# EAGLE schematic Backplane_2014 (EAGLE 5.06)
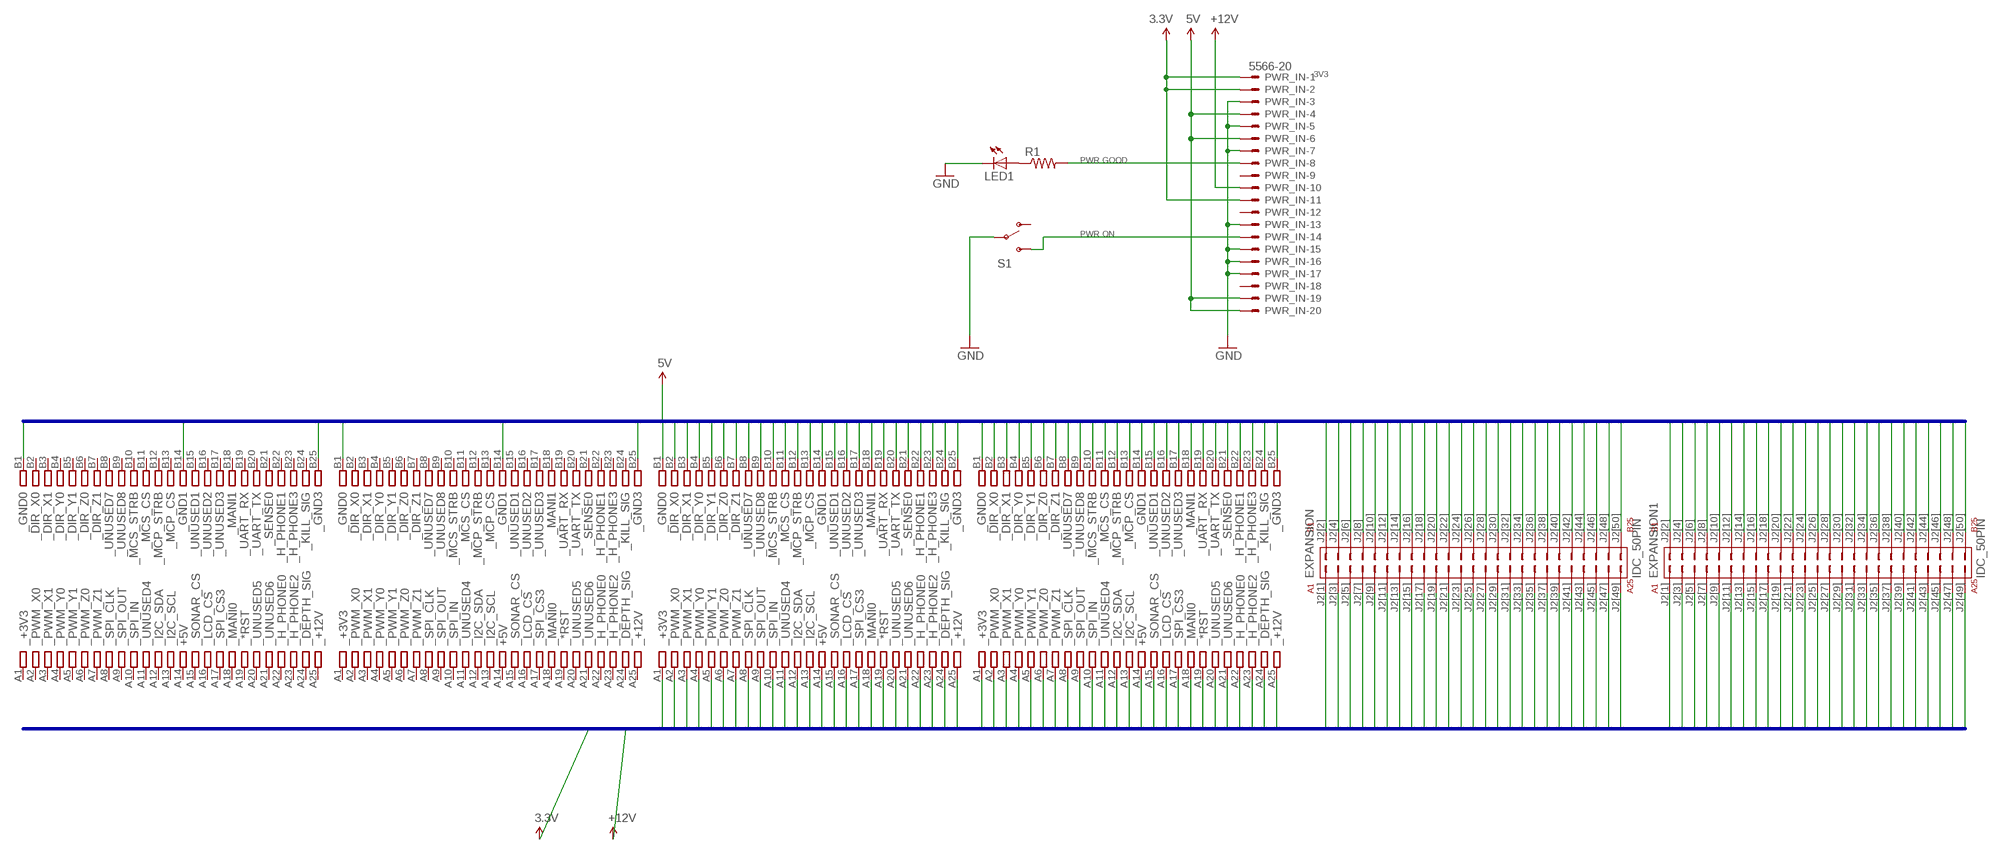
[diagram p0: schematic, sheet 1]

## Parts
EXPANSION  IDC_50PIN  [50PIN_BREAKOUT]
EXPANSION1  IDC_50PIN  [50PIN_BREAKOUT]
LED1  LED5MM  [LED5MM]
PWR_IN  5566-20  [5566-20]
R1  R-US_0204/7  [0204/7]
S1  SWITCH-SPST  [SWITCH-3PIN-5.47]
U$1  CONN_50PIN  [CONN_50PIN]
U$2  CONN_50PIN  [CONN_50PIN]
U$4  CONN_50PIN  [CONN_50PIN]
U$9  CONN_50PIN  [CONN_50PIN]

## Nets
3.3V: PWR_IN.1 PWR_IN.2 PWR_IN.11
3V3: EXPANSION1.J2[1](A1) EXPANSION.J2[1](A1) U$1.A1 U$2.A1 ; supply symbol labelled 3.3V
5V: EXPANSION1.J2[2](B1) EXPANSION.J2[2](B1) PWR_IN.4 PWR_IN.6 PWR_IN.19 PWR_IN.20 U$1.B1 U$2.B1
12V: EXPANSION1.J2[49](A25) EXPANSION.J2[49](A25) PWR_IN.10 U$1.A25 U$2.A25 ; supply symbol labelled +12V
DEPTH_SIG: EXPANSION1.J2[47](A24) EXPANSION.J2[47](A24) U$1.A24 U$2.A24
DIR_X0: EXPANSION1.J2[4](B2) EXPANSION.J2[4](B2) U$1.B2 U$2.B2
DIR_X1: EXPANSION1.J2[6](B3) EXPANSION.J2[6](B3) U$1.B3 U$2.B3
DIR_Y0: EXPANSION1.J2[8](B4) EXPANSION.J2[8](B4) U$1.B4 U$2.B4
DIR_Y1: EXPANSION1.J2[10](B5) EXPANSION.J2[10](B5) U$1.B5 U$2.B5
DIR_Z0: EXPANSION1.J2[12](B6) EXPANSION.J2[12](B6) U$1.B6 U$2.B6
DIR_Z1: EXPANSION1.J2[14](B7) EXPANSION.J2[14](B7) U$1.B7 U$2.B7
ETPU6: EXPANSION1.J2[15](A8) EXPANSION.J2[15](A8) U$1.A8 U$2.A8
ETPU7: EXPANSION1.J2[17](A9) EXPANSION.J2[17](A9) U$1.A9 U$2.A9
ETPU8: EXPANSION1.J2[19](A10) EXPANSION.J2[19](A10) U$1.A10 U$2.A10
ETPU9: EXPANSION1.J2[21](A11) EXPANSION.J2[21](A11) U$1.A11 U$2.A11
GND: EXPANSION1.J2[27](A14) EXPANSION1.J2[28](B14) EXPANSION1.J2[50](B25) EXPANSION.J2[27](A14) EXPANSION.J2[28](B14) EXPANSION.J2[50](B25) LED1.K(C) PWR_IN.3 PWR_IN.5 PWR_IN.7 PWR_IN.13 PWR_IN.15 PWR_IN.16 PWR_IN.17 S1.P$2(P) U$1.A14 U$1.B14 U$1.B25 U$2.A14 U$2.B14 U$2.B25 U$4.B1 U$4.B14 U$4.B25 U$9.B1 U$9.B14 U$9.B25
H_PHONE0: EXPANSION1.J2[43](A22) EXPANSION.J2[43](A22) U$1.A22 U$2.A22
H_PHONE1: EXPANSION1.J2[44](B22) EXPANSION.J2[44](B22) U$1.B22 U$2.B22
H_PHONE2: EXPANSION1.J2[45](A23) EXPANSION.J2[45](A23) U$1.A23 U$2.A23
H_PHONE3: EXPANSION1.J2[46](B23) EXPANSION.J2[46](B23) U$1.B23 U$2.B23
I2C_SCL: EXPANSION1.J2[25](A13) EXPANSION.J2[25](A13) U$1.A13 U$2.A13
I2C_SDA: EXPANSION1.J2[23](A12) EXPANSION.J2[23](A12) U$1.A12 U$2.A12
KILL_SIG: EXPANSION1.J2[48](B24) EXPANSION.J2[48](B24) U$1.B24 U$2.B24
MANI0: EXPANSION1.J2[35](A18) EXPANSION.J2[35](A18) U$1.A18 U$2.A18
MANI1: EXPANSION1.J2[36](B18) EXPANSION.J2[36](B18) U$1.B18 U$2.B18
MANI2: EXPANSION1.J2[37](A19) EXPANSION.J2[37](A19) U$1.A19 U$2.A19
MCP_CS: EXPANSION1.J2[20](B10) EXPANSION.J2[20](B10) U$1.B10 U$2.B10
MCP_STRB: EXPANSION1.J2[22](B11) EXPANSION.J2[22](B11) U$1.B11 U$2.B11
MCS_CS: EXPANSION1.J2[24](B12) EXPANSION.J2[24](B12) U$1.B12 U$2.B12
MCS_STRB: EXPANSION1.J2[26](B13) EXPANSION.J2[26](B13) U$1.B13 U$2.B13
N$1: LED1.A R1.1
N$10: PWR_IN.14 S1.P$3(S)
N$11: PWR_IN.8 R1.2
PWM_X0: EXPANSION1.J2[3](A2) EXPANSION.J2[3](A2) U$1.A2 U$2.A2
PWM_X1: EXPANSION1.J2[5](A3) EXPANSION.J2[5](A3) U$1.A3 U$2.A3
PWM_Y0: EXPANSION1.J2[7](A4) EXPANSION.J2[7](A4) U$1.A4 U$2.A4
PWM_Y1: EXPANSION1.J2[9](A5) EXPANSION.J2[9](A5) U$1.A5 U$2.A5
PWM_Z0: EXPANSION1.J2[11](A6) EXPANSION.J2[11](A6) U$1.A6 U$2.A6
PWM_Z1: EXPANSION1.J2[13](A7) EXPANSION.J2[13](A7) U$1.A7 U$2.A7
SENSE0: EXPANSION1.J2[38](B19) EXPANSION.J2[38](B19) U$1.B19 U$2.B19
SPARE0: EXPANSION1.J2[16](B8) EXPANSION.J2[16](B8) U$1.B8 U$2.B8
SPARE1: EXPANSION1.J2[18](B9) EXPANSION.J2[18](B9) U$1.B9 U$2.B9
SPARE2: EXPANSION1.J2[39](A20) EXPANSION.J2[39](A20) U$1.A20 U$2.A20
SPARE3: EXPANSION1.J2[40](B20) EXPANSION.J2[40](B20) U$1.B20 U$2.B20
SPARE4: EXPANSION1.J2[41](A21) EXPANSION.J2[41](A21) U$1.A21 U$2.A21
SPARE5: EXPANSION1.J2[42](B21) EXPANSION.J2[42](B21) U$1.B21 U$2.B21
SPI_CLK: EXPANSION1.J2[33](A17) EXPANSION.J2[33](A17) U$1.A17 U$2.A17
SPI_CS1: EXPANSION1.J2[30](B15) EXPANSION.J2[30](B15) U$1.B15 U$2.B15
SPI_CS2: EXPANSION1.J2[32](B16) EXPANSION.J2[32](B16) U$1.B16 U$2.B16
SPI_CS3: EXPANSION1.J2[34](B17) EXPANSION.J2[34](B17) U$1.B17 U$2.B17
SPI_IN: EXPANSION1.J2[29](A15) EXPANSION.J2[29](A15) U$1.A15 U$2.A15
SPI_OUT: EXPANSION1.J2[31](A16) EXPANSION.J2[31](A16) U$1.A16 U$2.A16
Unconnected: PWR_IN.9 PWR_IN.12 PWR_IN.18 S1.P$1(O) U$4.A1 U$4.A2 U$4.A3 U$4.A4 U$4.A5 U$4.A6 U$4.A7 U$4.A8 U$4.A9 U$4.A10 U$4.A11 U$4.A12 U$4.A13 U$4.A14 U$4.A15 U$4.A16 U$4.A17 U$4.A18 U$4.A19 U$4.A20 U$4.A21 U$4.A22 U$4.A23 U$4.A24 U$4.A25 U$4.B2 U$4.B3 U$4.B4 U$4.B5 U$4.B6 U$4.B7 U$4.B8 U$4.B9 U$4.B10 U$4.B11 U$4.B12 U$4.B13 U$4.B15 U$4.B16 U$4.B17 U$4.B18 U$4.B19 U$4.B20 U$4.B21 U$4.B22 U$4.B23 U$4.B24 U$9.A1 U$9.A2 U$9.A3 U$9.A4 U$9.A5 U$9.A6 U$9.A7 U$9.A8 U$9.A9 U$9.A10 U$9.A11 U$9.A12 U$9.A13 U$9.A14 U$9.A15 U$9.A16 U$9.A17 U$9.A18 U$9.A19 U$9.A20 U$9.A21 U$9.A22 U$9.A23 U$9.A24 U$9.A25 U$9.B2 U$9.B3 U$9.B4 U$9.B5 U$9.B6 U$9.B7 U$9.B8 U$9.B9 U$9.B10 U$9.B11 U$9.B12 U$9.B13 U$9.B15 U$9.B16 U$9.B17 U$9.B18 U$9.B19 U$9.B20 U$9.B21 U$9.B22 U$9.B23 U$9.B24

## Buses
5V,DIR_X0,DIR_X1,DIR_Y0,DIR_Y1,DIR_Z0,DIR_Z1,MCP_CS,MCP_STRB,MCS_CS,MCS_STRB,GND,SPI_CS1,SPI_CS2,SPI_CS3,MANI1,SENSE0,H_PHONE1,H_PHONE3,KILL_SIG,SPARE0,SPARE1,SPARE3,SPARE5
3V3,PWM_X0,PWM_X1,PWM_Y0,PWM_Y1,PWM_Z0,PWM_Z1,ETPU6,ETPU7,ETPU8,ETPU9,I2C_SDA,I2C_SCL,GND,SPI_IN,SPI_OUT,SPI_CLK,MANI0,MANI2,SPARE2,SPARE4,H_PHONE0,H_PHONE2,DEPTH_SIG,12V

## Notes on the sheet
- 3V3
- PWR GOOD
- PWR ON

## Library data of the parts
EXPANSION EXPANSION1 = ARVP:IDC_50PIN
LED1 = led:LED: LED OSRAM: - CHIPLED LG R971, LG N971, LY N971, LG Q971, LY Q971, LO R971, LY R971 LH N974, LH R974 LS Q976, LO Q976, LY Q976 LO Q996 - Hyper CHIPLED LW Q18S LB Q993, LB Q99A, LB R99A - SideLED LS A670, LO A670, LY A670, LG A670, LP A670 LB A673, LV A673, LT A673, LW A673 LH A674 LY A675 LS A676, LA A676, LO A676, LY A676, LW A676 LS A679, LY A679, LG A679 - Hyper Micro SIDELED® LS Y876, LA Y876, LO Y876, LY Y876 LT Y87S - SmartLED LW L88C, LW L88S LB L89C, LB L89S, LG L890 LS L89K, LO L89K, LY L89K LS L896, LA L896, LO L896, LY L896 - TOPLED LS T670, LO T670, LY T670, LG T670, LP T670 LSG T670, LSP T670, LSY T670, LOP T670, LYG T670 LG T671, LOG T671, LSG T671 LB T673, LV T673, LT T673, LW T673 LH T674 LS T676, LA T676, LO T676, LY T676, LB T676, LH T676, LSB T676, LW T676 LB T67C, LV T67C, LT T67C, LS T67K, LO T67K, LY T67K, LW E67C LS E67B, LA E67B, LO E67B, LY E67B, LB E67C, LV E67C, LT E67C LW T67C LS T679, LY T679, LG T679 LS T770, LO T770, LY T770, LG T770, LP T770 LB T773, LV T773, LT T773, LW T773 LH T774 LS E675, LA E675, LY E675, LS T675 LS T776, LA T776, LO T776, LY T776, LB T776 LHGB T686 LT T68C, LB T68C - Hyper Mini TOPLED® LB M676 - Mini TOPLED Santana® LG M470 LS M47K, LO M47K, LY M47K Source: http://www.osram.convergy.de LUXEON: - LUMILED® LXK2-PW12-R00, LXK2-PW12-S00, LXK2-PW14-U00, LXK2-PW14-V00 LXK2-PM12-R00, LXK2-PM12-S00, LXK2-PM14-U00 LXK2-PE12-Q00, LXK2-PE12-R00, LXK2-PE12-S00, LXK2-PE14-T00, LXK2-PE14-U00 LXK2-PB12-K00, LXK2-PB12-L00, LXK2-PB12-M00, LXK2-PB14-N00, LXK2-PB14-P00, LXK2-PB14-Q00 LXK2-PR12-L00, LXK2-PR12-M00, LXK2-PR14-Q00, LXK2-PR14-R00 LXK2-PD12-Q00, LXK2-PD12-R00, LXK2-PD12-S00 LXK2-PH12-R00, LXK2-PH12-S00 LXK2-PL12-P00, LXK2-PL12-Q00, LXK2-PL12-R00 Source: www.luxeon.com KINGBRIGHT: KA-3528ASYC Source: www.kingbright.com
PWR_IN = con-molex:5566-20: Mini FIT connector 20 pol ATX PC-Motherboard Power connector Source: http://www.molex.com; OC_FARNELL: unknown; OC_NEWARK: unknown
R1 = resistor:R-US_: RESISTOR, American symbol
S1 = ARVP:SWITCH-SPST: SPST Switch Simple slide switch. Spark Fun Electronics SKU : COM-00102
U$1 U$2 U$4 U$9 = ARVP:CONN_50PIN